# EAGLE design pcb_univ_3-8-0-x-rev1 (EAGLE 5.11)
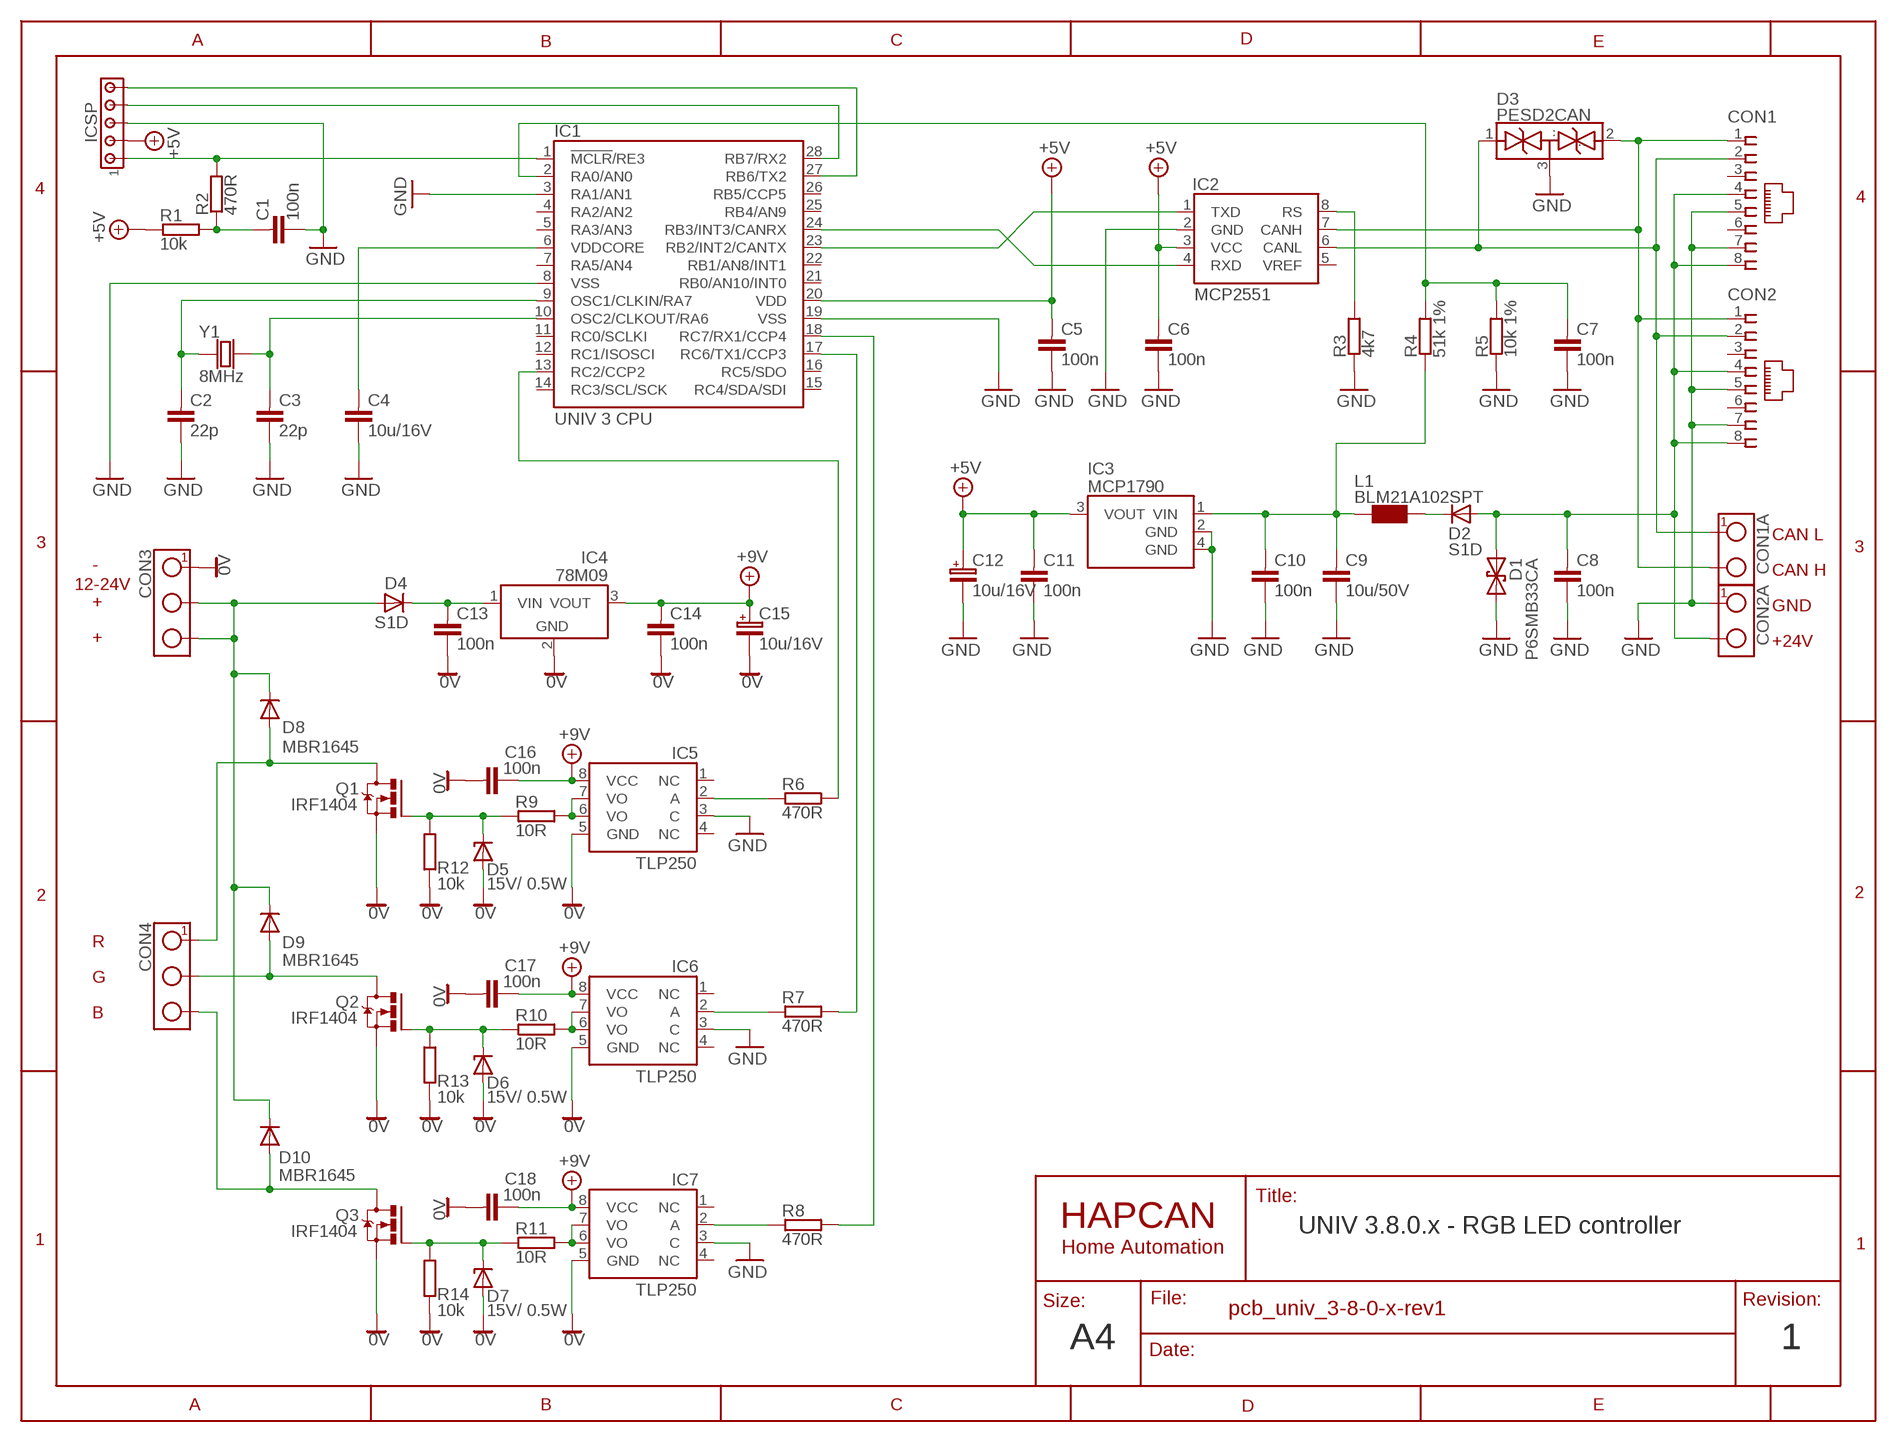
[diagram p0: schematic, sheet 1]

## Parts
C1  100n  CAPACITOR0805  [0805]
C2  22p  CAPACITOR0805  [0805]
C3  22p  CAPACITOR0805  [0805]
C4  10u/16V  CAPACITOR0805  [0805]
C5  100n  CAPACITOR0805  [0805]
C6  100n  CAPACITOR0805  [0805]
C7  100n  CAPACITOR0805  [0805]
C8  100n  CAPACITOR0805  [0805]
C9  10u/50V  CAPACITOR1210  [1210]
C10  100n  CAPACITOR0805  [0805]
C11  100n  CAPACITOR0805  [0805]
C12  10u/16V  CAPACITOR-POLARIZED-SMC_B  [SMC_B]
C13  100n  CAPACITOR0805  [0805]
C14  100n  CAPACITOR0805  [0805]
C15  10u/16V  CAPACITOR-POLARIZED-SMC_B  [SMC_B]
C16  100n  CAPACITOR0805  [0805]
C17  100n  CAPACITOR0805  [0805]
C18  100n  CAPACITOR0805  [0805]
CON1  RJ45-SOCKET  [RJ45-PCB-SOCKET]
CON1A  TERMINAL-2  TERMINAL-2-5X10,5MM  [ARK2-5X10,5MM]
CON2  RJ45-SOCKET  [RJ45-PCB-SOCKET]
CON2A  TERMINAL-2  TERMINAL-2-5X10,5MM  [ARK2-5X10,5MM]
CON3  TERMINAL-3  TERMINAL-3-5X10.5MM  [ARK3-5X10.5MM]
CON4  TERMINAL-3  TERMINAL-3-5X10.5MM  [ARK3-5X10.5MM]
D1  P6SMB33CA  DIODE_TRANSIL  [DO-214_TRANSIL2]
D2  S1D  DIODE_DO-214  [DO-214]
D3  PESD2CAN  PESD2CANSOT-23  [SOT-23]
D4  S1D  DIODE_DO-214  [DO-214]
D5  15V/ 0.5W  DIODE_ZENER_SOD-80  [SOD-80]
D6  15V/ 0.5W  DIODE_ZENER_SOD-80  [SOD-80]
D7  15V/ 0.5W  DIODE_ZENER_SOD-80  [SOD-80]
D8  MBR1645  DIODE_TO220V  [TO220V-2]
D9  MBR1645  DIODE_TO220V  [TO220V-2]
D10  MBR1645  DIODE_TO220V  [TO220V-2]
IC1  UNIV 3 CPU  UNIV3(CPU)  [UNIV3CPU]
IC2  MCP2551  [SO-08]
IC3  MCP1790  [SOT-223]
IC4  78M09  78XX-TO-252  [TO-252]
IC5  TLP250  [DIL-08]
IC6  TLP250  [DIL-08]
IC7  TLP250  [DIL-08]
ICSP  HEADER5  [SIP-5]
L1  BLM21A102SPT  BLMXXX  [0805@1]
Q1  IRF1404  MOSFET-N  [TO220V]
Q2  IRF1404  MOSFET-N  [TO220V]
Q3  IRF1404  MOSFET-N  [TO220V]
R1  10k  RESISTOR  [0805]
R2  470R  RESISTOR  [0805]
R3  4k7  RESISTOR  [0805]
R4  51k 1%  RESISTOR  [0805]
R5  10k 1%  RESISTOR  [0805]
R6  470R  RESISTOR  [0805]
R7  470R  RESISTOR  [0805]
R8  470R  RESISTOR  [0805]
R9  10R  RESISTOR  [0805]
R10  10R  RESISTOR  [0805]
R11  10R  RESISTOR  [0805]
R12  10k  RESISTOR  [0805]
R13  10k  RESISTOR  [0805]
R14  10k  RESISTOR  [0805]
Y1  8MHz  CRYSTALHC49V  [CRYSTAL-HC49V]

## Nets
0V: C13.2 C14.2 C15.- C16.1 C17.1 C18.1 CON3.1 D5.A D6.A D7.A IC4.2(GND) IC5.5(GND) IC6.5(GND) IC7.5(GND) Q1.3(S) Q2.3(S) Q3.3(S) R12.1 R13.1 R14.1
+5V: C5.1 C6.1 C11.1 C12.+ IC1.20(VDD) IC2.3(VCC) IC3.3(VOUT) ICSP.2 R1.1
+9V: C14.1 C15.+ C16.2 C17.2 C18.2 IC4.3(VOUT) IC5.8(VCC) IC6.8(VCC) IC7.8(VCC)
GND: C1.2 C2.2 C3.2 C4.2 C5.2 C6.2 C7.2 C8.2 C9.2 C10.2 C11.2 C12.- CON1.5 CON1.7 CON2.5 CON2.7 CON2A.1 D1.C D3.3(...) IC1.3(RA1/AN1) IC1.8(VSS) IC1.19(VSS) IC2.2(GND) IC3.2(GND) IC3.4(GND) IC5.3(C) IC6.3(C) IC7.3(C) ICSP.3 R3.1 R5.1
N$1: CON3.2 CON3.3 D4.A D8.1(C) D9.1(C) D10.1(C)
N$2: IC1.24(RB3/INT3/CANRX) IC2.4(RXD)
N$3: IC1.23(RB2/INT2/CANTX) IC2.1(TXD)
N$4: CON1.1 CON1A.2 CON2.1 D3.2(..) IC2.7(CANH)
N$5: IC5.6(VO) IC5.7(VO) R9.2
N$6: IC6.6(VO) IC6.7(VO) R10.2
N$7: C1.1 R1.2 R2.1
N$8: IC1.1(!MCLR!/RE3) ICSP.1 R2.2
N$9: C8.1 CON1.4 CON1.8 CON2.4 CON2.8 CON2A.2 D1.A D2.A
N$10: IC1.28(RB7/RX2) ICSP.4
N$11: IC6.2(A) R7.1
N$12: IC2.8(RS) R3.2
N$13: C13.1 D4.C IC4.1(VIN)
N$14: IC1.27(RB6/TX2) ICSP.5
N$15: C3.1 IC1.10(OSC2/CLKOUT/RA6) Y1.2
N$16: C7.1 IC1.2(RA0/AN0) R4.2 R5.2
N$17: C9.1 C10.1 IC3.1(VIN) L1.1 R4.1
N$18: IC5.2(A) R6.1
N$19: IC1.13(RC2/CCP2) R6.2
N$20: IC1.17(RC6/TX1/CCP3) R7.2
N$21: IC1.18(RC7/RX1/CCP4) R8.2
N$24: CON4.2 D9.3(A) Q2.2(D)
N$26: D6.C Q2.1(G) R10.1 R13.2
N$27: CON1.2 CON1A.1 CON2.2 D3.1(.) IC2.6(CANL)
N$28: IC7.6(VO) IC7.7(VO) R11.2
N$29: IC7.2(A) R8.1
N$30: D5.C Q1.1(G) R9.1 R12.2
N$32: CON4.1 D8.3(A) Q1.2(D)
N$33: CON4.3 D10.3(A) Q3.2(D)
N$34: D7.C Q3.1(G) R11.1 R14.2
N$40: C2.1 IC1.9(OSC1/CLKIN/RA7) Y1.1
N$56: C4.1 IC1.6(VDDCORE)
N$67: D2.C L1.2
Unconnected: CON1.3 CON1.6 CON2.3 CON2.6 IC1.4(RA2/AN2) IC1.5(RA3/AN3) IC1.7(RA5/AN4) IC1.11(RC0/SCLKI) IC1.12(RC1/ISOSCI) IC1.14(RC3/SCL/SCK) IC1.15(RC4/SDA/SDI) IC1.16(RC5/SDO) IC1.21(RB0/AN10/INT0) IC1.22(RB1/AN8/INT1) IC1.25(RB4/AN9) IC1.26(RB5/CCP5) IC2.5(VREF) IC5.1(NC) IC5.4(NC) IC6.1(NC) IC6.4(NC) IC7.1(NC) IC7.4(NC)

## Notes on the sheet
- CAN L
- -
- CAN H
- 12-24V
- + | GND
- + | +24V
- R
- G
- B
- UNIV 3.8.0.x - RGB LED controller
- A4 | 1

## Library data of the parts
C1-C11 C13 C14 C16-C18 = HAPCAN_devices - UNIV3:CAPACITOR: HAPCAN Capacitor
C12 C15 = HAPCAN_devices - UNIV3:CAPACITOR-POLARIZED: HAPCAN Polarazied Capacitor
CON1 CON2 = HAPCAN_devices - UNIV3:RJ45-SOCKET: HAPCAN RJ45 socket
CON1A CON2A = HAPCAN_devices - UNIV3:TERMINAL-2: HAPCAN Terminal Block - 2 way
CON3 CON4 = HAPCAN_devices - UNIV3:TERMINAL-3: HAPCAN Terminal Block - 3 way
D1 = HAPCAN_devices - UNIV3:DIODE_TRANSIL: Transil diode
D2 D4 D8-D10 = HAPCAN_devices - UNIV3:DIODE: HAPCAN Rectifier Diode
D3 = HAPCAN_devices - UNIV3:PESD2CAN: CAN bus ESD protection diode
D5-D7 = HAPCAN_devices - UNIV3:DIODE_ZENER: HAPCAN ZENER DIODE
IC1 = HAPCAN_devices - UNIV3:UNIV3(CPU): HAPCAN Microcontroller UNIV 3 (CPU)
IC2 = HAPCAN_devices - UNIV3:MCP2551: HAPCAN CAN Tranceiver
IC3 = HAPCAN_devices - UNIV3:MCP1790: 70 mA, High Voltage Regulator
IC4 = HAPCAN_devices - UNIV3:78XX: HAPCAN POSITIVE VOLATGE REGULATOR
IC5-IC7 = HAPCAN_devices - UNIV3:TLP250: TLP250
ICSP = HAPCAN_devices - UNIV3:HEADER5: HAPCAN Header 5
L1 = HAPCAN_devices - UNIV3:BLMXXX: Choke
Q1-Q3 = HAPCAN_devices - UNIV3:MOSFET-N: HAPCAN N-MOSFET
R1-R14 = HAPCAN_devices - UNIV3:RESISTOR: HAPCAN Resistor
Y1 = HAPCAN_devices - UNIV3:CRYSTAL: HAPCAN Crystal

## Board
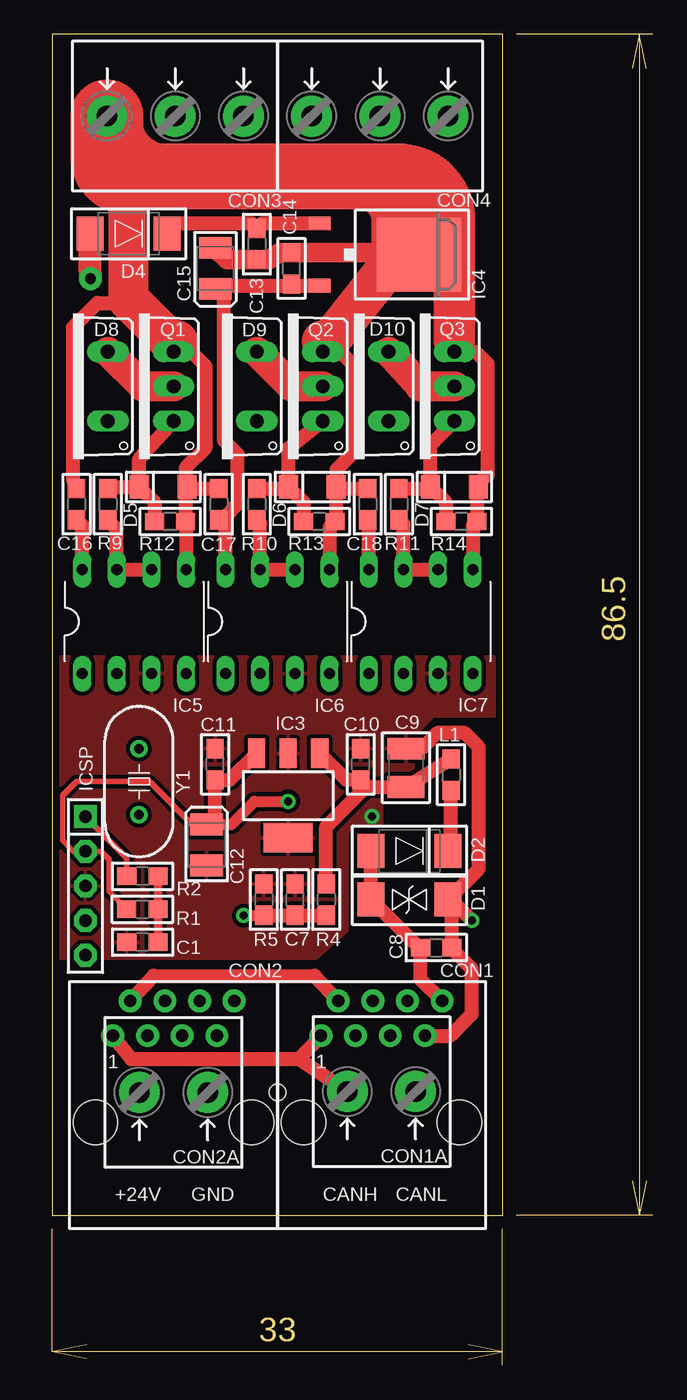
[diagram p1: board, top side]
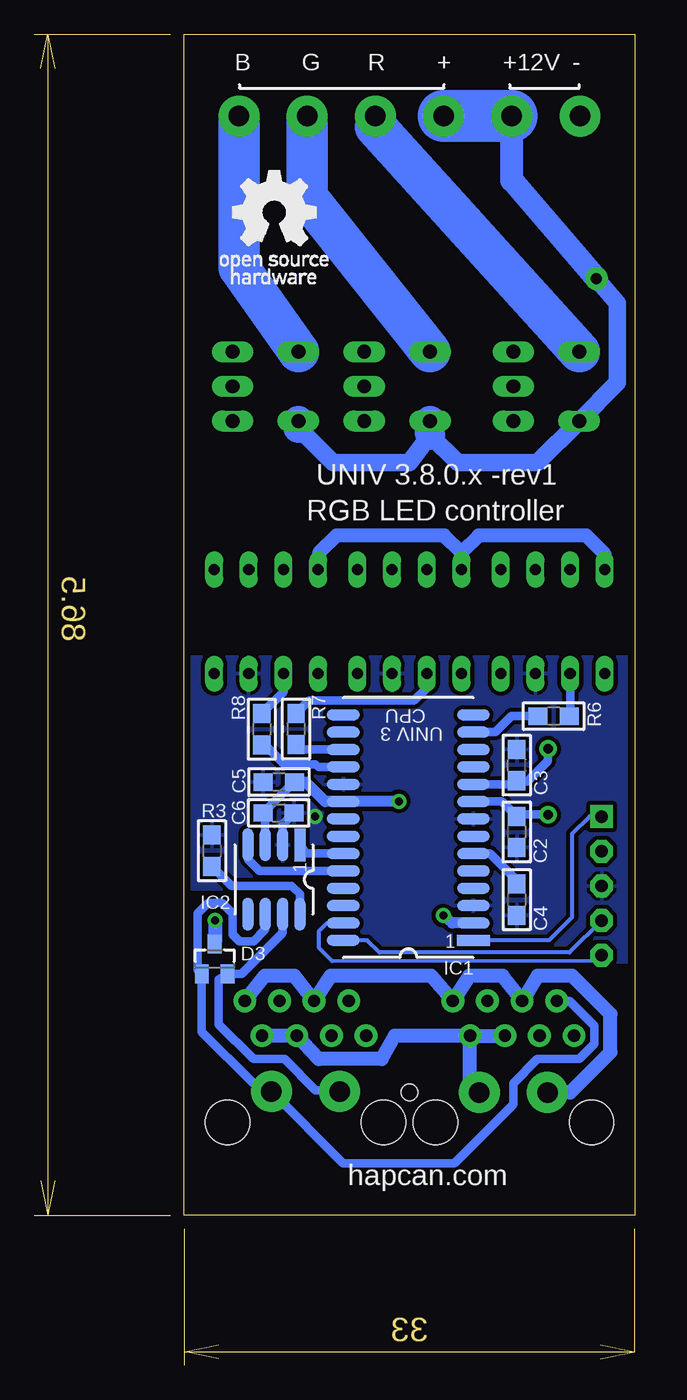
[diagram p2: board, bottom side, seen from below]

Size 44 x 97.5 mm. Coordinates in mm from the lower left corner, seen from the top.
Outline: 43.99,11 44,11 43,11
Outline: 43,11 34,11
Outline: 43,97.5 43,11
Outline: 44,97.5 43,97.5
Outline: 43,97.5 34,97.5
Outline: 43.5,95 43,97.5
Outline: 42.5,13.5 43,11
Outline: 43,97.5 42.5,95
Outline: 43.5,13.5 43,11
Outline: 0,1 0,10
Outline: 32.98,1 0,1
Outline: 32.98,0 32.98,1
Outline: 32.98,1 32.98,10
Outline: 30.48,0.5 32.98,1
Outline: 2.5,1.5 0,1
Outline: 32.98,1 30.48,1.5
Outline: 2.5,0.5 0,1
Outline: 0,11 33,11 33,97.5 0,97.5 0,11
Copper layers (1*16): Top 0.035mm / dielectric 1.5mm / Bottom 0.035mm
Design rules "HAPCAN-Drc": minimum track width 10mil, minimum drill 0.5mm, track to track 12mil, track to pad 12mil, pad to pad 12mil, via to via 12mil, smd to smd 10mil, copper to edge 20mil, drill to drill 8mil, minimum pad ring 10mil, minimum via ring 10mil, stop-mask expansion 4mil, vias tented up to drill 0mil, thermal gap 10mil
Holes 1.2 mm at 16.5,20
tKeepout: 4 lines

### Footprints (pad centres in the part's own frame; a part is rotated, then mirrored left to right if it is on the bottom)
0805 = smd 1.397 x 1.27: 1 -1.143,0; 2 1.143,0
1210 = smd 1.6 x 2.7: 1 -1.4,0; 2 1.4,0
SMC_B = smd 1.6 x 2.4: + -1.5,0; - 1.5,0
RJ45-PCB-SOCKET = drill 0.9 pad 1.676 round: 1 -4.445,6.35; 2 -3.175,8.89; 3 -1.905,6.35; 4 -0.635,8.89; 5 0.635,6.35; 6 1.905,8.89; 7 3.175,6.35; 8 4.445,8.89 | hole 3.251: -5.715,0; 5.715,0
ARK2-5X10,5MM = drill 1.5 pad 3 round: 1 -2.5,0; 2 2.5,0
ARK3-5X10.5MM = drill 1.5 pad 3 round: 1 -5,0; 2 0,0; 3 5,0
DO-214_TRANSIL2@1 = smd 2 x 2.5: A 2.82,0; C -2.82,0
DO-214 = smd 2 x 2.5: A 2.82,0; C -2.82,0
SOT-23 = smd 1 x 1.4: 1 -0.95,-1.1; 2 0.95,-1.1; 3 0,1.1
SOD-80 = smd 1.4 x 1.7: A 1.75,0; C -1.75,0
TO220V-2 = drill 1.016 long: 1 -2.54,0; 3 2.54,0
UNIV3CPU@1 = smd 2.4 x 0.8: 1 -4.763,8.255; 2 -4.763,6.985; 3 -4.763,5.715; 4 -4.763,4.445; 5 -4.763,3.175; 6 -4.763,1.905; 7 -4.763,0.635; 8 -4.763,-0.635; 9 -4.763,-1.905; 10 -4.763,-3.175; 11 -4.763,-4.445; 12 -4.763,-5.715; 13 -4.763,-6.985; 14 -4.763,-8.255; 15 4.763,-8.255; 16 4.763,-6.985; 17 4.763,-5.715; 18 4.763,-4.445; 19 4.763,-3.175; 20 4.763,-1.905; 21 4.763,-0.635; 22 4.763,0.635; 23 4.763,1.905; 24 4.763,3.175; 25 4.763,4.445; 26 4.763,5.715; 27 4.763,6.985; 28 4.763,8.255
SO-08 = smd 2.4 x 0.8: 1 -2.54,1.905; 2 -2.54,0.635; 3 -2.54,-0.635; 4 -2.54,-1.905; 5 2.54,-1.905; 6 2.54,-0.635; 7 2.54,0.635; 8 2.54,1.905
SOT-223 = smd 1.27 x 2.159: 1 -2.311,-3.099; 2 0,-3.099; 3 2.311,-3.099 | smd 3.556 x 2.159: 4 0,3.099
TO-252 = smd 1 x 1.6: 1 -2.28,-4.8; 3 2.28,-4.8 | smd 5.4 x 6.2: 2 0,2.5
DIL-08 = drill 0.813 pad 1.27 long: 1 -3.81,-3.81; 2 -1.27,-3.81; 3 1.27,-3.81; 4 3.81,-3.81; 5 3.81,3.81; 6 1.27,3.81; 7 -1.27,3.81; 8 -3.81,3.81
SIP-5 = drill 0.9 pad 1.676 square: 1 -5.08,0 | drill 0.9 pad 1.676 octagon: 2 -2.54,0; 3 0,0; 4 2.54,0; 5 5.08,0
0805@1 = smd 1.397 x 1.27: 1 -1.143,0; 2 1.143,0
TO220V = drill 1.016 long: 1 -2.54,0; 2 0,0; 3 2.54,0
CRYSTAL-HC49V = drill 0.7 pad 1.27 round: 1 -2.413,0; 2 2.413,0

### Placement (x,y rotation side)
C1  6.61,30.99 180 top
C2  8.64,39.07 270 bottom
C3  8.64,43.96 90 bottom
C4  8.64,34.11 270 bottom
C5  26.07,42.72 180 bottom
C6  26.09,40.46 0 bottom
C7  17.78,34.11 90 top
C8  28.13,30.61 0 top
C9  25.91,43.77 90 top
C10  22.59,44.02 90 top
C11  11.93,44.02 90 top
C12  11.31,38.11 270 top
C13  14.99,82.12 270 top
C14  17.53,80.34 90 top
C15  11.94,80.34 90 top
C16  1.78,63.07 270 top
C17  12.19,63.07 270 top
C18  23.11,63.07 270 top
CON1  24.12,17.8 0 top
CON1A  24.12,20.06 180 top
CON2  8.88,17.8 0 top
CON2A  8.88,19.99 180 top
CON3  9,91.5 0 top
CON4  24,91.5 0 top
D1  P6SMB33CA  [DO-214_TRANSIL2@1]  26.16,34.11 180 top
D2  26.16,37.67 180 top
D3  30.77,29.77 0 bottom
D4  5.59,82.88 180 top
D5  8.13,64.34 0 top
D6  19.05,64.34 0 top
D7  29.46,64.34 0 top
D8  4.06,71.71 90 top
D9  14.99,71.71 90 top
D10  24.64,71.71 90 top
IC1  UNIV 3 CPU  [UNIV3CPU@1]  16.58,39.39 180 bottom
IC2  26.43,35.58 270 bottom
IC3  17.27,41.73 180 top
IC4  24.38,81.36 270 top
IC5  6,54.48 0 top
IC6  16.5,54.48 0 top
IC7  27,54.48 0 top
ICSP  2.42,35.11 270 top
L1  29.21,43.26 270 top
Q1  8.89,71.71 90 top
Q2  19.81,71.71 90 top
Q3  29.46,71.71 90 top
R1  6.6,33.4 0 top
R2  6.61,35.82 180 top
R3  30.97,37.7 270 bottom
R4  20.07,34.11 270 top
R5  15.49,34.11 270 top
R6  5.94,47.55 180 bottom
R7  24.81,46.61 270 bottom
R8  27.32,46.59 270 bottom
R9  4.06,63.07 270 top
R10  14.99,63.07 270 top
R11  25.4,63.07 270 top
R12  8.64,61.8 180 top
R13  19.56,61.8 180 top
R14  29.97,61.8 180 top
Y1  6.35,42.75 90 top

### Tracks (layer width: path | path; a pad name or v marks a point on that pad's centre or on a via)
0V
  Top 0.406: D5.A 9.91,64.37
  Top 0.813: Q3.3 30.99,74.25 | Q2.3 21.08,74.25
  Top 1.016: IC5.5 9.81,61.77 R12.1 9.78,64.24 | 9.78,64.24 D5.A 9.88,64.21 C17.1 | D6.A 20.8,61.9 R13.1 20.31,61.41 IC6.5 | IC7.5 30.81,61.49 R14.1 31.11,64.24 | 31.11,64.24 D7.A | D6.A 20.83,64.37 20.83,65.61 22.23,67.01 22.23,73.1 21.08,74.25 | 20.57,74.25 20.57,74.5 20.07,75.01 | 9.78,64.24 9.78,65.74 11.23,67.19 11.23,73.18 10.16,74.25 Q1.3 | C18.1 20.93,64.21 D6.A | C16.1 1.78,64.09 1.52,64.85 1.52,76.02 3.3,77.8 5.33,77.8 5.59,78.06 | 31.11,64.24 31.11,64.47 31.88,65.23 31.88,73.36 30.99,74.25
  Top 1.27: 29.46,75.01 Q3.3 | 19.81,75.01 Q2.3 | 9.14,75.01 Q1.3 | 22.61,86.95 arc90 23.37,86.18 24.38,86.18
  Top 1.422: C15.- 12.8,80.98 C13.2 15.88,80.98 16.64,81.48 C14.2 24.87,81.48 arc-90 25.4,81.47
  Top 2.921: 5.59,78.06 5.59,86.95 5.08,91.52
  Top 3.048: 5.08,91.52 arc100 8.64,87.96 | 29.46,83.64 29.46,75.01 | 29.46,84.15 29.46,83.64 | 8.64,87.96 8.38,87.96 6.6,86.18 24.38,86.18 | 19.81,75.01 20.07,75.01 20.32,75.01 25.4,81.47 25.91,82.12 IC4.2 26.38,83.94 | 9.14,75.01 8.64,75.01 5.59,78.06 | 8.64,87.96 25.65,87.96 arc-83 29.46,84.15 | 29.46,84.15 arc-7 29.46,83.64
  Top 4.572: 26.38,83.94 arc81 22.61,86.95 arc-90 25.65,83.9 25.65,82.12
  Top 5.334: CON3.1 4,88.53 arc90 5.59,86.95
+5V  (via drill 0.6)
  Top 0.406: C12.+ 10.25,39.61 7.11,42.75 1.78,42.75 0.76,41.73 0.76,38.43 1.54,37.65 ICSP.2 3.57,37.65 4.17,37.06 4.17,34.69 R1.1
  Top 0.813: C12.+ 13.12,39.61 14.81,41.3 v17.27,41.3
  Top 1.016: C12.+ 11.93,40.23 C11.1 13.01,42.88 IC3.3
  Bottom 0.61: IC2.3 27.07,40.3 C6.1 24.97,42.72 C5.1 24.1,42.72
  Bottom 0.813: 24.1,42.72 22.67,41.29 IC1.20 17.28,41.29 v17.27,41.3
+9V
  Top 0.61: C15.+ 12.06,78.97
  Top 0.813: C17.2 12.24,61.93 | 12.45,78.59 C15.+ | 13.59,63.07 13.59,65.23
  Top 1.016: 12.69,62.17 C17.2 | IC6.8 12.69,62.17 | IC4.3 17.9,79.08 C14.1 17.14,79.07 12.95,79.07 12.72,79.1 C15.+ | C16.2 2.19,61.52 IC5.8 | C18.2 23.19,61.85 IC7.8 | 12.69,62.17 13.59,63.07 | 12.45,78.59 12.6,78.16 12.6,67.72 13.59,66.73 13.59,65.23
  Bottom 1.016: IC7.8 23.11,58.36 23.11,59.51 21.84,60.78 13.97,60.78 12.7,59.51 | 12.7,59.51 IC6.8 | IC5.8 2.19,59.42 3.56,60.78 11.43,60.78 12.7,59.51
GND  (via drill 0.6)
  Top 1.016: CON1.7 29.15,24.15 30.73,25.73 30.73,29.03 29.27,30.5 C8.2 29.27,33.82 D1.C | D1.C 29.21,34.11 v30.73,32.59 | D1.C 31.24,36.37 31.24,45.29 30.23,46.31 28.19,46.31 27.18,45.29 26.03,45.29 C9.2
  Bottom 0.61: IC2.2 25.8,39.61 C6.2
  Bottom 1.016: CON2.7 CON2.5 | CON2.7 17.58,24.15 18.54,22.43 23.15,22.43 CON1.5 CON1.7 | CON2.7 12.05,20.67 CON2A.1 | v30.73,32.59 30.73,31.16 D3.3
  other vias: 23.42,40.21
  pour Top (isolate 0.305): 0,51.89 33.02,51.89 33.02,47.58 27.94,47.58 26.42,46.05 26.42,42.75 24.13,41.99 24.13,39.7 22.35,39.7 21.59,38.94 21.59,31.83 19.3,29.8 0,29.8
  pour Bottom (isolate 0.305): 0,51.89 33.02,51.89 33.02,34.88 25.15,34.88 24.64,34.37 24.64,31.07 23.11,29.54 0,29.54
N$1  (via drill 0.8 pad 1.68)
  Top 1.676: D4.A 2.77,80.62 v2.79,79.58
  Bottom 1.27: 24.64,68.66 22.1,66.12 16.51,66.12 14.99,68.15 12.95,66.12 7.11,66.12 D8.1 1.27,71.96 1.27,77.8 v2.79,79.58
  Bottom 1.524: CON3.2 9,88.58
  Bottom 1.676: v2.79,79.58 9,86.8 CON3.2
  Bottom 2.184: 24.64,68.66 D10.1 | 14.99,68.15 D9.1
  Bottom 3.81: CON3.2 CON3.3
N$2
  Bottom 0.61: IC1.24 27.5,36.21 28.34,37.05 IC2.4
N$3
  Bottom 0.61: IC1.23 24.06,37.48 IC2.1
N$4
  Top 1.016: 18.07,22.43 CON1.1 | 18.07,22.43 5.76,22.43 CON2.1 | 18.07,22.43 CON1A.2
  Bottom 0.61: CON1A.2 21.71,20.14 23.37,20.14 25.65,22.43 27.94,22.43 30.48,24.97 30.48,28.27 D3.2 28.81,28.67 25.8,31.68 IC2.7
N$5
  Top 1.016: IC5.6 IC5.7 4.73,61.26 R9.2
N$6
  Top 1.016: IC6.6 IC6.7 15.23,61.68 R10.2
N$7
  Top 0.61: C1.1 7.75,31.25 R1.2 R2.1
N$8
  Top 0.406: ICSP.1 5.46,37.16 R2.2
  Bottom 0.305: IC1.1 6.28,31.13 4.57,32.84 4.57,38.94 3.3,40.21 2.44,40.21 ICSP.1
N$9
  Top 1.016: CON1.8 26.99,28.27 C8.1 26.85,30.61 D1.A D2.A
  Bottom 1.016: CON1.8 27.1,28.53 24.93,28.53 CON1.4 22.27,28.53 14.91,28.53 CON2.8 12.12,28.53 9.69,28.53 CON2.4 7.11,28.53 4.57,28.53 1.78,25.73 1.78,22.94 4.72,19.99 CON2A.2
N$10
  Bottom 0.305: IC1.28 19.6,31.13 18.69,30.23 4.77,30.23 ICSP.4
N$11
  Bottom 0.61: IC6.2 15.23,49.62 16.15,48.69 23.88,48.69 R7.1
N$12
  Bottom 0.61: IC2.8 24.53,34.51 25.15,35.13 29.55,35.13 R3.2
N$13
  Top 1.016: IC4.1 15.36,83.64 C13.1 14.61,83.64 8.92,83.64 D4.C
N$14
  Bottom 0.305: ICSP.5 2.41,29.59 22.17,29.62 23.11,30.56 23.11,31.83 22.57,32.38 IC1.27
N$15
  Bottom 0.61: IC1.10 8.89,42.56 C3.1 | C3.1 8.44,42.62 | Y1.2 6.35,44.27 7.87,42.75 8.57,42.75 C3.1
N$16  (via drill 0.6)
  Top 0.813: R5.2 13.95,32.97 v14.02,32.95
  Top 1.016: R5.2 C7.1 R4.2
  Bottom 0.813: IC1.2 13.38,32.4 v14.02,32.95
N$17
  Top 1.016: L1.1 C9.1 23.1,42.37 23.04,42.42 | 23.04,42.42 C10.1 21.54,42.88 IC3.1 | R4.1 20.07,39.45 23.04,42.42
N$18
  Bottom 0.61: IC5.2 4.73,47.61 R6.1
N$19
  Bottom 0.61: R6.2 9.04,47.55 10.22,46.37 IC1.13
N$20
  Bottom 0.61: IC1.17 24.45,45.1 R7.2
N$21
  Bottom 0.61: IC1.18 23.18,43.83 23.37,44.02 25.64,44.02 27.07,45.45 R8.2
N$24
  Top 2.184: Q2.2 17.53,71.71 D9.3
  Bottom 3.048: CON4.2 24,85.55 D9.3
N$26
  Top 1.016: R10.1 17.17,64.21 D6.C | R13.2 18.41,63.23 D6.C | D6.C 17.3,67.16 Q2.1
N$27
  Top 1.016: CON2.2 7.41,28.53 19.23,28.53 CON1.2
  Bottom 0.61: CON2.2 4.77,26.69 2.95,24.87 2.95,23.55 4.06,22.43 7.11,22.43 8.89,20.65 8.89,19.13 13.21,14.81 21.37,14.81 CON1A.1 27.22,20.65 27.94,20.65 31.72,24.43 D3.1 32,28.95 32,33.1 31.24,33.86 30.23,33.86 29.46,33.1 29.46,31.57 28.96,31.07 27.94,31.07 27.07,31.94 IC2.6
N$28
  Top 1.016: IC7.6 IC7.7 25.73,61.6 R11.2
N$29
  Bottom 0.61: IC7.2 25.73,49.33 R8.1
N$30
  Top 0.406: D5.C 6.25,64.21
  Top 1.016: R9.1 4.19,64.34 D5.C | R12.2 7.49,63.23 D5.C | D5.C 6.38,66.4 Q1.1
N$32
  Top 2.184: Q1.2 6.6,71.71 D8.3
  Bottom 2.184: 19,90.71 CON4.1
  Bottom 3.048: D8.3 19,90.71
N$33
  Top 2.184: Q3.2 26.92,71.71 D10.3
  Bottom 3.048: CON4.3 29,80.39 D10.3
N$34
  Top 1.016: R11.1 27.59,64.21 D7.C | R14.2 28.83,63.23 D7.C | D7.C 27.71,67.42 Q3.1
N$40
  Bottom 0.61: IC1.9 9.72,41.29 C2.1 8.51,40.34 Y1.1
N$56
  Bottom 0.61: 8.64,35.14 C4.1 8.64,35.52 10.61,37.48 IC1.6
N$67
  Top 1.016: D2.C 29.21,38.66 L1.2

### Text on the board
Dimension: 86.5 | 33
tPlace: +24V | GND | CANH | CANL
bPlace: - | +12V | + | R | G | B | UNIV 3.8.0.x -rev1 | RGB LED controller | hapcan.com